# Altium schematic sheet ATMEGA32U4+Micro+Ver1.2.schdoc
size 316 x 220 mm
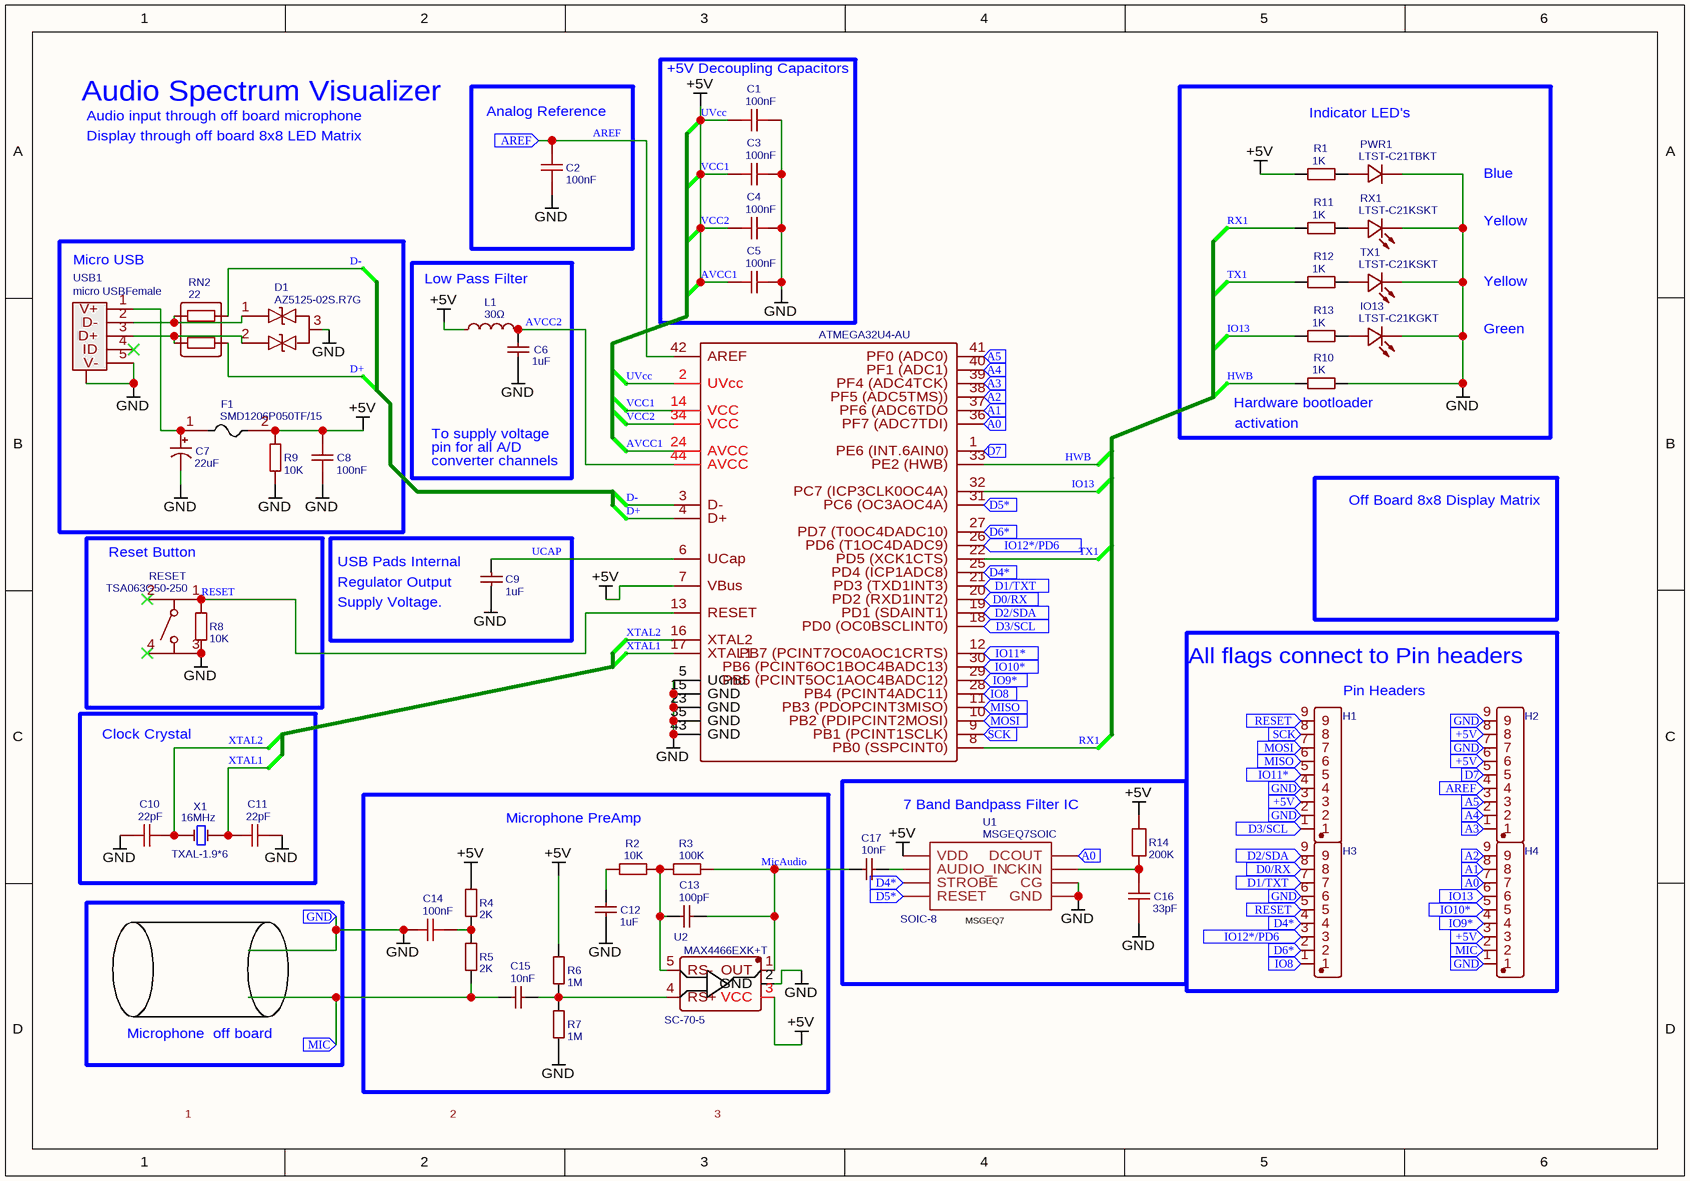
[diagram p0: ATMEGA32U4+Micro+Ver1.2.schdoc]

## Parts
ATMEGA32U4  ATMEGA32U4-AU  [QFP-44_10X10X08P]
C1  100nF  [0603]
C2  100nF  [0603]
C3  100nF  [0603]
C4  100nF  [0603]
C5  100nF  [0603]
C6  1uF  [0603]
C7  22uF  [CAP-SMD_BD5.0-L5.3-W5.3-FD]
C8  100nF  [0603]
C9  1uF  [0603]
C10  22pF  [CAP_0603]
C11  22pF  [CAP_0603]
C12  1uF  [0603]
C13  100pF  [0603]
C14  100nF  [0603]
C15  10nF  [0603]
C16  33pF  [0603]
C17  10nF  [0603]
D1  AZ5125-02S.R7G  [SOT-23-3_L2.9-W1.6-P1.90-LS2.8-BR]
F1  SMD1206P050TF/15  [FUSE-1206]
H1  A2541WV-9P  [SIP-2.54MM-9P-CJT-H8.54]  (value not drawn)
H2  A2541WV-9P  [SIP-2.54MM-9P-CJT-H8.54]  (value not drawn)
H3  A2541WV-9P  [SIP-2.54MM-9P-CJT-H8.54]  (value not drawn)
H4  A2541WV-9P  [SIP-2.54MM-9P-CJT-H8.54]  (value not drawn)
IO13  LTST-C21KGKT  [LED-SMD-3.2X1.6X1.1]
L1  30Ω  [0805]
PWR1  LTST-C21TBKT  [LED-SMD-3.2X1.6X1.1]
R1  1K  [0603]
R2  10K  [0603]
R3  100K  [0603]
R4  2K  [0603]
R5  2K  [0603]
R6  1M  [0603]
R7  1M  [0603]
R8  10K  [0603]
R9  10K  [0603]
R10  1K  [0603]
R11  1K  [0603]
R12  1K  [0603]
R13  1K  [0603]
R14  200K  [R0603]
RESET  TSA063G50-250  [SW-SMD-T6X6-9.5X5.8]
RN2  22  [RES-ARRAY-SMD_0402-4P-L1.0-W1.0-BL]
RX1  LTST-C21KSKT  [LED-SMD-3.2X1.6X1.1]
TX1  LTST-C21KSKT  [LED-SMD-3.2X1.6X1.1]
U1  MSGEQ7SOIC  [SOIC-8]
U2  MAX4466EXK+T  [SC-70-5]
USB1  micro USBFemale  [MICRO-USB-1]
X1  16MHz  [TXAL-1.9*6]

## Blocks framed on the sheet
+5V Decoupling Capacitors: C1 C3-C5
Analog Reference: C2
Micro USB: C7 C8 D1 F1 R9 RN2 USB1
Reset Button: R8 RESET
All flags connect to Pin headers: H1-H4
Clock Crystal: C10 C11 X1
Microphone PreAmp: C12-C15 R2-R7 U2
7 Band Bandpass Filter IC: C16 C17 R14 U1

## Ports
+5V, A0, A1, A2, A3, A4, A5, AREF, D0/RX, D1/TXT, D2/SDA, D3/SCL, D4*, D5*, D6*, D7, GND, IO8, IO9*, IO10*, IO11*, IO12*/PD6, IO13, MIC, MISO, MOSI, RESET, SCK

## Nets
AVCC1: ATMEGA32U4.2(UVcc) ATMEGA32U4.7(VBus) ATMEGA32U4.14(VCC) ATMEGA32U4.24(AVCC) ATMEGA32U4.34(VCC) C1.2 C3.2 C4.2 C5.2 C8.2 F1.2 L1.1 R1.1 R4.2 R6.2 R9.2 R14.2 U1.1(VDD) U2.3(VCC)  [also labelled +5V, UVcc, VCC1, VCC2]
GND: ATMEGA32U4.5(UGnd) ATMEGA32U4.15(GND) ATMEGA32U4.23(GND) ATMEGA32U4.35(GND) ATMEGA32U4.43(GND) C1.1 C2.1 C3.1 C4.1 C5.1 C6.1 C7.2 C8.1 C10.2 C11.1 C12.2 C14.2 C16.1 D1.3 H1.2 H1.4 H2.7 H2.9 H3.6 H4.1 IO13.1(C) PWR1.2(-) R7.1 R8.1 R9.1 R10.2 RESET.3 RX1.1(C) TX1.1(C) U1.2(GND) U1.6(CG) U2.2(GND) USB1.0(MTN) USB1.5(V-) ; port GND
+5V: H1.3 H2.6 H2.8 H4.3 ; port +5V
A0: ATMEGA32U4.36(PF7_(ADC7TDI)) H4.7 U1.3(DCOUT) ; port A0
A1: ATMEGA32U4.37(PF6_(ADC6TDO) H4.8 ; port A1
A2: ATMEGA32U4.38(PF5_(ADC5TMS))) H4.9 ; port A2
A3: ATMEGA32U4.39(PF4_(ADC4TCK)) H2.1 ; port A3
A4: ATMEGA32U4.40(PF1_(ADC1)) H2.2 ; port A4
A5: ATMEGA32U4.41(PF0_(ADC0)) H2.3 ; port A5
AREF: ATMEGA32U4.42(AREF) C2.2 H2.4 ; port AREF
AVCC2: ATMEGA32U4.44(AVCC) C6.2 L1.2
D0/RX: ATMEGA32U4.20(PD2_(RXD1INT2)) H3.8 ; port D0/RX
D1/TXT: ATMEGA32U4.21(PD3_(TXD1INT3)) H3.7 ; port D1/TXT
D2/SDA: ATMEGA32U4.19(PD1_(SDAINT1)) H3.9 ; port D2/SDA
D3/SCL: ATMEGA32U4.18(PD0_(OC0BSCLINT0)) H1.1 ; port D3/SCL
D4*: ATMEGA32U4.25(PD4_(ICP1ADC8)) H3.4 U1.4(STROBE) ; port D4*
D5*: ATMEGA32U4.31(PC6_(OC3AOC4A)) U1.7(RESET) ; port D5*
D6*: ATMEGA32U4.27(PD7_(T0OC4DADC10)) H3.2 ; port D6*
D7: ATMEGA32U4.1(PE6_(INT.6AIN0)) H2.5 ; port D7
D+: ATMEGA32U4.4(D+) RN2.1
D-: ATMEGA32U4.3(D-) RN2.2
HWB: ATMEGA32U4.33(PE2_(HWB)) R10.1
IO8: ATMEGA32U4.28(PB4_(PCINT4ADC11)) H3.1 ; port IO8
IO9*: ATMEGA32U4.29(PB5_(PCINT5OC1AOC4BADC12)) H4.4 ; port IO9*
IO10*: ATMEGA32U4.30(PB6_(PCINT6OC1BOC4BADC13)) H4.5 ; port IO10*
IO11*: ATMEGA32U4.12(PB7_(PCINT7OC0AOC1CRTS)) H1.5 ; port IO11*
IO12*/PD6: ATMEGA32U4.26(PD6_(T1OC4DADC9)) H3.3 ; port IO12*/PD6
IO13: ATMEGA32U4.32(PC7_(ICP3CLK0OC4A)) R13.1
IO13: H4.6 ; port IO13  [a separate net that carries the same name]
MIC: C15.1 H4.2 R5.1 ; port MIC
MicAudio: C13.1 C17.1 R3.2 U2.1(OUT)
MISO: ATMEGA32U4.11(PB3_(PDOPCINT3MISO)) H1.6 ; port MISO
MOSI: ATMEGA32U4.10(PB2_(PDIPCINT2MOSI)) H1.7 ; port MOSI
RESET: ATMEGA32U4.13(RESET) R8.2 RESET.1
RESET: H1.9 H3.5 ; port RESET  [a separate net that carries the same name]
RX1: ATMEGA32U4.8(PB0_(SSPCINT0)) R11.1
SCK: ATMEGA32U4.9(PB1_(PCINT1SCLK)) H1.8 ; port SCK
TX1: ATMEGA32U4.22(PD5_(XCK1CTS)) R12.1
UCAP: ATMEGA32U4.6(UCap) C9.1
XTAL1: ATMEGA32U4.17(XTAL1) C11.2 X1.2(OSC2)
XTAL2: ATMEGA32U4.16(XTAL2) C10.1 X1.1(OSC1)
NetC7_1: C7.1 F1.1 USB1.1(V+)
NetC12_1: C12.1 R2.1
NetC13_2: C13.2 R2.2 R3.1 U2.5(RS-)
NetC14_1: C14.1 R4.1 R5.2
NetC15_2: C15.2 R6.1 R7.2 U2.4(RS+)
NetC16_2: C16.2 R14.1 U1.8(CKIN)
NetC17_2: C17.2 U1.5(AUDIO_IN)
NetD1_1: D1.1 RN2.3 USB1.2(D-)
NetD1_2: D1.2 RN2.4 USB1.3(D+)
NetIO13_2: IO13.2(A) R13.2
NetPWR1_1: PWR1.1(+) R1.2
NetR11_2: R11.2 RX1.2(A)
NetR12_2: R12.2 TX1.2(A)

Not connected (* = marked no-connect by the designer): C9 2; RESET 2* 4*; USB1 4(ID)*

## Notes on the sheet
- Audio Spectrum Visualizer
- Audio input through off board microphone
- Indicator LED's
- Display through off board 8x8 LED Matrix
- Blue
- Yellow
- Low Pass Filter
- Green
- To supply voltage
- pin for all A/D
- (near R10) Hardware bootloader
- (near R10) activation
- converter channels
- Off Board 8x8 Display Matrix
- (near C9) USB Pads Internal
- (near C9) Regulator Output
- Supply Voltage.
- (near H1) Pin Headers
- Microphone  off board
- 1
- 2
- 3
- Labels drawn without touching a wire or pin: GND
- (in symbol 16MHz) TXAL-1.9*6
- (in symbol MAX4466EXK+T) SC-70-5
- (in symbol MSGEQ7SOIC) SOIC-8; MSGEQ7

## Library data of the parts
ATMEGA32U4 = ATMEGA32U4-AU: BOM_Manufacturer: MICROCHIP; SMT Type: Extend; BOM_Supplier: LCSC; BOM_Manufacturer Part: ATMEGA32U4-AU; image: //image.lceda.cn/szlcsc/C44854.jpg; BOM_Supplier Part: C44854; BOM_LCSC Assembly: Yes; spicePre: U
C1-C5 C8 C14 = 100nF: BOM_Manufacturer: FH; BOM_Manufacturer Part: 0603B104J500NT; nameAlias: Capacitance; BOM_Supplier: LCSC; BOM_Supplier Part: C88136; spicePre: C; spiceSymbolName: 0603B104J500NT
C6 C12 = 1uF: BOM_Manufacturer Part: CL10A105KP8NNNC; BOM_Manufacturer: SAMSUNG; nameAlias: Capacitance; BOM_Supplier: LCSC; BOM_Supplier Part: C26413; spicePre: C; spiceSymbolName: CL10A105KP8NNNC
C7 = 22uF: BOM_Manufacturer: HONOR; BOM_Manufacturer Part: RVT1V220M0505; nameAlias: Capacitance; BOM_Supplier: LCSC; BOM_Supplier Part: C23289; spicePre: C; spiceSymbolName: RVT1V220M0505-C23289
C9 = 1uF: BOM_Manufacturer Part: CL10A105KP8NNNC; BOM_Manufacturer: SAMSUNG; nameAlias: Capacitance; Package Display: No; BOM_Supplier: LCSC; BOM_Supplier Part: C26413; spicePre: C; spiceSymbolName: CL10A105KP8NNNC
C10 C11 = 22pF: BOM_Manufacturer: Walsin Tech Corp; BOM_Manufacturer Part: 0603N220F500CT; nameAlias: Capacitance; Contributor: LCSC; BOM_Supplier: LCSC; BOM_Supplier Part: C388038; spicePre: C; spiceSymbolName: 0603N220F500CT
C13 = 100pF: BOM_Manufacturer: FH; BOM_Manufacturer Part: 0603CG101J500NT; nameAlias: Capacitance; SMT Type: Extend; BOM_Supplier: LCSC; BOM_Supplier Part: C1635; BOM_LCSC Assembly: Yes; spicePre: C; spiceSymbolName: 0603CG101J500NT
C15 C17 = 10nF: BOM_Manufacturer: FH; BOM_Manufacturer Part: 0603B103J500NT; nameAlias: Capacitance; Contributor: LCSC; BOM_Supplier: LCSC; BOM_Supplier Part: C124567; spicePre: C; spiceSymbolName: 0603B103J500NT
C16 = 33pF: BOM_Manufacturer: Walsin Tech Corp; BOM_Manufacturer Part: 0603N330F500CT; nameAlias: Capacitance; Contributor: LCSC; BOM_Supplier: LCSC; BOM_Supplier Part: C296062; spicePre: C; spiceSymbolName: 0603N330F500CT
D1 = AZ5125-02S.R7G: BOM_Manufacturer: AMAZING; Contributor: LCSC; BOM_Supplier: LCSC; BOM_Supplier Part: C356820; BOM_Manufacturer Part: AZ5125-02S.R7G; spicePre: D
F1 = SMD1206P050TF/15: BOM_Manufacturer: PTTC; BOM_Supplier: LCSC; BOM_Manufacturer Part: SMD1206P050TF/15; BOM_Supplier Part: C106264; spicePre: F
H1-H4 = A2541WV-9P: BOM_Manufacturer: Changjiang Connectors; Contributor: LCSC; BOM_Supplier: LCSC; BOM_Supplier Part: C225484; BOM_Manufacturer Part: A2541WV-9P; spicePre: H
IO13 = LTST-C21KGKT: BOM_Manufacturer: Lite-On; Contributor: LCSC; BOM_Supplier: LCSC; BOM_Supplier Part: C284938; BOM_Manufacturer Part: LTST-C21KGKT; spicePre: L
L1 = 30Ω: BOM_Manufacturer: ReliaPro; BOM_Manufacturer Part: MLB2012-300P3A(f); nameAlias: Value; BOM_Supplier: LCSC; BOM_Supplier Part: C50503; spicePre: L; spiceSymbolName: MLB2012-300P3A(f)
PWR1 = LTST-C21TBKT: BOM_Manufacturer: Lite-On; Contributor: LCSC; BOM_Supplier: LCSC; BOM_Supplier Part: C284941; BOM_Manufacturer Part: LTST-C21TBKT; spicePre: L
R1 R10-R13 = 1K: BOM_Manufacturer: FH; BOM_Manufacturer Part: RS-03K1001FT; nameAlias: Resistance (Ohms); BOM_Supplier: LCSC; BOM_Supplier Part: C115325; spicePre: R; spiceSymbolName: RS-03K1001FT
R2 R8 R9 = 10K: BOM_Manufacturer: RALEC; BOM_Manufacturer Part: RTT031002BTP; nameAlias: Resistance (Ohms); Contributor: LCSC; BOM_Supplier: LCSC; BOM_Supplier Part: C305012; spicePre: R; spiceSymbolName: RTT031002BTP
R3 = 100K: BOM_Manufacturer: YAGEO; BOM_Manufacturer Part: RC0603FR-07100KL; nameAlias: Resistance (Ohms); Contributor: LCSC; BOM_Supplier: LCSC; BOM_Supplier Part: C14675; spicePre: R; spiceSymbolName: RC0603FR-07100KL
R4 R5 = 2K: BOM_Manufacturer: YAGEO; BOM_Manufacturer Part: RC0603FR-072KL; nameAlias: Resistance (Ohms); BOM_Supplier: LCSC; BOM_Supplier Part: C105576; spicePre: R; spiceSymbolName: RC0603FR-072KL
R6 R7 = 1M: BOM_Manufacturer: YAGEO; BOM_Manufacturer Part: RC0603FR-071ML; nameAlias: Resistance (Ohms); BOM_Supplier: LCSC; BOM_Supplier Part: C105578; spicePre: R; spiceSymbolName: RC0603FR-071ML
R14 = 200K: BOM_Manufacturer: Ever Ohms Tech; BOM_Manufacturer Part: CR0603F200KP05; nameAlias: Resistance (Ohms); Contributor: LCSC; BOM_Supplier: LCSC; BOM_Supplier Part: C429255; spicePre: R; spiceSymbolName: CR0603F200KP05
RESET = TSA063G50-250: BOM_Manufacturer: BRIGHT; Contributor: LCSC; BOM_Supplier: LCSC; BOM_Supplier Part: C294565; BOM_Manufacturer Part: TSA063G50-250; spicePre: S
RN2 = 22: BOM_Manufacturer: YAGEO; BOM_Manufacturer Part: AF122-JR-0722RL; nameAlias: Resistance (Ohms); Contributor: LCSC; BOM_Supplier: LCSC; BOM_Supplier Part: C309445; spicePre: R; spiceSymbolName: AF122-JR-0722RL
RX1 TX1 = LTST-C21KSKT: BOM_Manufacturer: Lite-On; Contributor: LCSC; BOM_Supplier: LCSC; BOM_Supplier Part: C284940; BOM_Manufacturer Part: LTST-C21KSKT; spicePre: L
U1 = MSGEQ7SOIC: description: 7-band graphic equalizer; Contributor: SparkFun; Package Display: Yes; spicePre: U
U2 = MAX4466EXK+T: BOM_Manufacturer: Maxim Integrated; BOM_Manufacturer Part: MAX4073TAXK+T; Contributor: LCSC; SMT Type: Extend; Package Display: Yes; BOM_Supplier: LCSC; BOM_Supplier Part: C143459; BOM_LCSC Assembly: Yes; spicePre: U
USB1 = micro USBFemale: BOM_Manufacturer: ValuePro; BOM_Supplier: LCSC; BOM_Manufacturer Part: micro USBFemale; image: //image.lceda.cn/szlcsc/C10418.jpg; BOM_Supplier Part: C10418; spicePre: U
X1 = 16MHz: BOM_Manufacturer Part: X206016MSD2SC; BOM_Manufacturer: YXC; nameAlias: Frequency; Package Display: Yes; BOM_Supplier: LCSC; BOM_Supplier Part: C2174; spicePre: X; spiceSymbolName: X206016MSD2SC